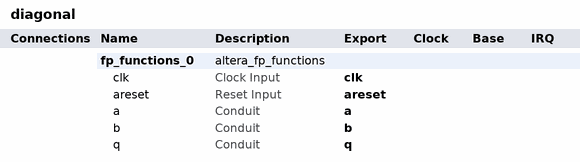
[diagram p0: system contents]
# Platform Designer (Qsys) system diagonal, Arria 10 10AX115S2F45I2SG
# Parameters at their usual value, and those the tool derives, are not listed.
package require -exact qsys 16.1
create_system diagonal
set_project_property DEVICE_FAMILY {Arria 10}
set_project_property DEVICE 10AX115S2F45I2SG

add_instance fp_functions_0 altera_fp_functions 16.1
set_instance_property fp_functions_0 AUTO_EXPORT true
set_instance_parameter_value fp_functions_0 ALL_function ADD
set_instance_parameter_value fp_functions_0 ARITH_function SUB
set_instance_parameter_value fp_functions_0 COMPARE_function MIN
set_instance_parameter_value fp_functions_0 CONVERT_function FXP_FP
set_instance_parameter_value fp_functions_0 EXP_LOG_function EXPE
set_instance_parameter_value fp_functions_0 FUNCTION_FAMILY ARITH
set_instance_parameter_value fp_functions_0 ROOTS_function SQRT
set_instance_parameter_value fp_functions_0 TRIG_function SIN
set_instance_parameter_value fp_functions_0 divide_type 0
set_instance_parameter_value fp_functions_0 enable_hard_fp true
set_instance_parameter_value fp_functions_0 exponent_width 23
set_instance_parameter_value fp_functions_0 faithful_rounding false
set_instance_parameter_value fp_functions_0 forceRegisters 1111
set_instance_parameter_value fp_functions_0 fp_exp 8
set_instance_parameter_value fp_functions_0 fp_format single
set_instance_parameter_value fp_functions_0 fp_in_exp 8
set_instance_parameter_value fp_functions_0 fp_in_format single
set_instance_parameter_value fp_functions_0 fp_in_man 23
set_instance_parameter_value fp_functions_0 fp_man 23
set_instance_parameter_value fp_functions_0 fp_out_exp 8
set_instance_parameter_value fp_functions_0 fp_out_format single
set_instance_parameter_value fp_functions_0 fp_out_man 23
set_instance_parameter_value fp_functions_0 frequency_target 300
set_instance_parameter_value fp_functions_0 fxpt_fraction 0
set_instance_parameter_value fp_functions_0 fxpt_sign 1
set_instance_parameter_value fp_functions_0 fxpt_width 32
set_instance_parameter_value fp_functions_0 gen_enable false
set_instance_parameter_value fp_functions_0 latency_target 3
set_instance_parameter_value fp_functions_0 manual_dsp_planning true
set_instance_parameter_value fp_functions_0 number_of_inputs 2
set_instance_parameter_value fp_functions_0 performance_goal latency
set_instance_parameter_value fp_functions_0 report_resources_to_xml false
set_instance_parameter_value fp_functions_0 rounding_mode {nearest with tie breaking away from zero}
set_instance_parameter_value fp_functions_0 scale_by_pi false
set_instance_parameter_value fp_functions_0 select_signal_enable false
set_instance_parameter_value fp_functions_0 selected_device_family {Arria 10}
set_instance_parameter_value fp_functions_0 selected_device_speedgrade 2
set_instance_parameter_value fp_functions_0 trig_no_range_reduction false

# exported interfaces
add_interface a conduit end
set_interface_property a EXPORT_OF fp_functions_0.a
add_interface areset reset sink
set_interface_property areset EXPORT_OF fp_functions_0.areset
add_interface b conduit end
set_interface_property b EXPORT_OF fp_functions_0.b
add_interface clk clock sink
set_interface_property clk EXPORT_OF fp_functions_0.clk
add_interface q conduit end
set_interface_property q EXPORT_OF fp_functions_0.q

set_interconnect_requirement {$system} qsys_mm.clockCrossingAdapter HANDSHAKE
set_interconnect_requirement {$system} qsys_mm.enableEccProtection FALSE
set_interconnect_requirement {$system} qsys_mm.insertDefaultSlave FALSE
set_interconnect_requirement {$system} qsys_mm.maxAdditionalLatency 1

save_system diagonal.qsys
